# Altium schematic sheet Microcontroller.SchDoc
size A4; SheetNumber: 4; SheetTotal: 6
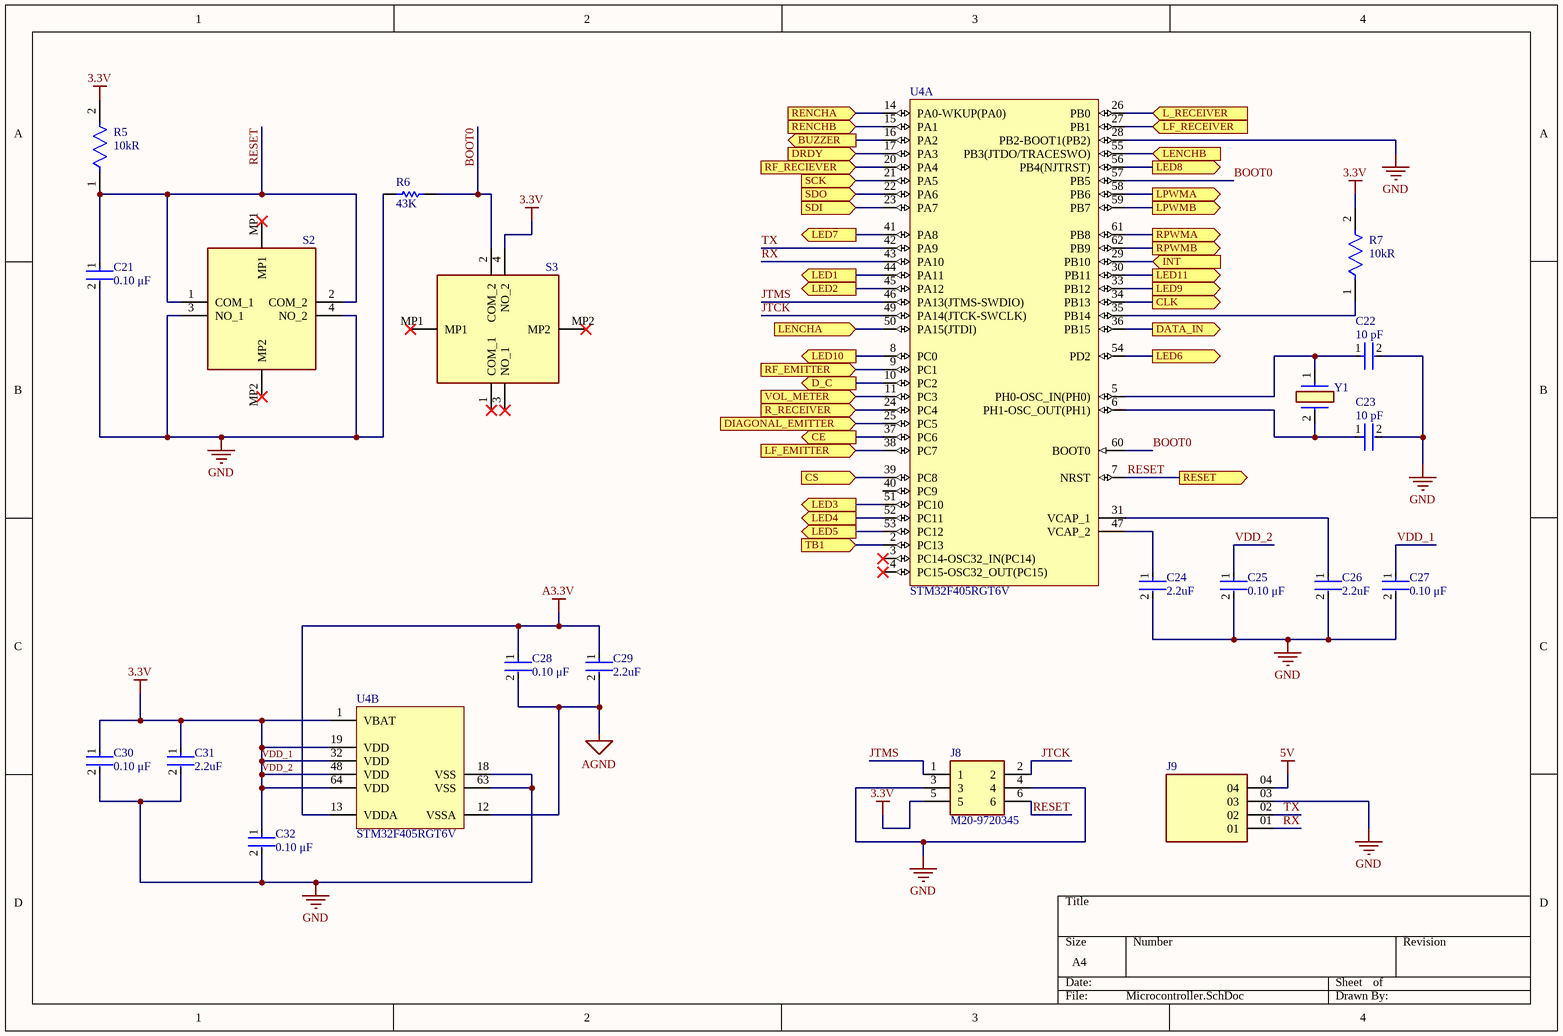
[diagram p0: Microcontroller.SchDoc]

## Parts
C21  value 0.10 μF  [FP-C0805C-DN-MFG]  (hidden comment: C0805C104J8RACTU)
C22  value 10 pF  [FP-C0805C-DN-MFG]  (hidden comment: C0805C100K5GACTU)
C23  value 10 pF  [FP-C0805C-DN-MFG]  (hidden comment: C0805C100K5GACTU)
C24  Capacitance: 2.2uF  [FP-C2012-125-0_2-IPC_C]  (hidden comment: C2012X5R1H225K125AB)
C25  value 0.10 μF  [FP-C0805C-DN-MFG]  (hidden comment: C0805C104J8RACTU)
C26  Capacitance: 2.2uF  [FP-C2012-125-0_2-IPC_C]  (hidden comment: C2012X5R1H225K125AB)
C27  value 0.10 μF  [FP-C0805C-DN-MFG]  (hidden comment: C0805C104J8RACTU)
C28  value 0.10 μF  [FP-C0805C-DN-MFG]  (hidden comment: C0805C104J8RACTU)
C29  Capacitance: 2.2uF  [FP-C2012-125-0_2-IPC_C]  (hidden comment: C2012X5R1H225K125AB)
C30  value 0.10 μF  [FP-C0805C-DN-MFG]  (hidden comment: C0805C104J8RACTU)
C31  Capacitance: 2.2uF  [FP-C2012-125-0_2-IPC_C]  (hidden comment: C2012X5R1H225K125AB)
C32  value 0.10 μF  [FP-C0805C-DN-MFG]  (hidden comment: C0805C104J8RACTU)
J8  M20-9720345  [HDRV6W64P254_2X3_762X508X864P]
J9  TS-104-G-AA  [SAMTEC_TS-104-G-AA]  (value not drawn)
R5  Resistance: 10kR  [FP-ERA3A-IPC_C]  (hidden comment: ERA-3AEB103V)
R6  value 43K  [RESC1608X55X30ML20T20]  (hidden comment: ERA3AEB433V)
R7  Resistance: 10kR  [FP-ERA3A-IPC_C]  (hidden comment: ERA-3AEB103V)
S2  TS21-34-035-BK-160-SMT-TR  [TS2134035BK160SMTTR]  (value not drawn)
S3  TS21-34-035-BK-160-SMT-TR  [TS2134035BK160SMTTR]  (value not drawn)
U4  STM32F405RGT6V  [STM-LQFP64_V]  (parts A,B of 2)
Y1  NX5032GA-16.000M-LN-CD-1  [NX5032GA16000000MHZLNCD1]  (value not drawn)

## Ports
BUZZER (out), CE (out), CLK (out), CS (in), D_C (out), DATA_IN (out), DIAGONAL_EMITTER (in), DRDY (in), INT (in), L_RECEIVER (in), LED1 (out), LED2 (out), LED3 (out), LED4 (out), LED5 (out), LED6 (out), LED7 (out), LED8 (out), LED9 (out), LED10 (out), LED11 (out), LENCHA (in), LENCHB (in), LF_EMITTER (in), LF_RECEIVER (in), LPWMA (out), LPWMB (out), R_RECEIVER (in), RENCHA (in), RENCHB (in), RESET (out), RF_EMITTER (in), RF_RECIEVER (in), RPWMA (out), RPWMB (out), SCK (in), SDI (in), SDO (in), TB1 (in), VOL_METER (in)

## Nets
5V: J9.04
A3.3V: C28.1 C29.1 U4.13(VDDA)
AGND: C28.2 C29.2 U4.12(VSSA)
GND: C21.2 C22.2 C23.2 C24.2 C25.2 C26.2 C27.2 C30.2 C31.2 C32.2 J8.3 J8.4 J9.03 R6.2 S2.3(NO_1) S2.4(NO_2) U4.18(VSS) U4.28(PB2-BOOT1(PB2)) U4.63(VSS)
VDD_1: C25.1 C27.1 C30.1 C31.1 C32.1 J8.5 R5.2 R7.2 S3.4(NO_2) U4.1(VBAT) U4.19(VDD) U4.32(VDD) U4.48(VDD) U4.64(VDD)  [also labelled 3.3V, VDD_2]
BOOT0: R6.1 S3.2(COM_2) U4.57(PB5) U4.60(BOOT0)
BUZZER: U4.16(PA2) ; port BUZZER
CE: U4.37(PC6) ; port CE
CLK: U4.34(PB13) ; port CLK
CS: U4.39(PC8) ; port CS
D_C: U4.10(PC2) ; port D_C
DATA_IN: U4.36(PB15) ; port DATA_IN
DIAGONAL_EMITTER: U4.25(PC5) ; port DIAGONAL_EMITTER
DRDY: U4.17(PA3) ; port DRDY
INT: U4.29(PB10) ; port INT
JTCK: J8.2 U4.49(PA14(JTCK-SWCLK))
JTMS: J8.1 U4.46(PA13(JTMS-SWDIO))
L_RECEIVER: U4.26(PB0) ; port L_RECEIVER
LED1: U4.44(PA11) ; port LED1
LED2: U4.45(PA12) ; port LED2
LED3: U4.51(PC10) ; port LED3
LED4: U4.52(PC11) ; port LED4
LED5: U4.53(PC12) ; port LED5
LED6: U4.54(PD2) ; port LED6
LED7: U4.41(PA8) ; port LED7
LED8: U4.56(PB4(NJTRST)) ; port LED8
LED9: U4.33(PB12) ; port LED9
LED10: U4.8(PC0) ; port LED10
LED11: U4.30(PB11) ; port LED11
LENCHA: U4.50(PA15(JTDI)) ; port LENCHA
LENCHB: U4.55(PB3(JTDO/TRACESWO)) ; port LENCHB
LF_EMITTER: U4.38(PC7) ; port LF_EMITTER
LF_RECEIVER: U4.27(PB1) ; port LF_RECEIVER
LPWMA: U4.58(PB6) ; port LPWMA
LPWMB: U4.59(PB7) ; port LPWMB
R_RECEIVER: U4.24(PC4) ; port R_RECEIVER
RENCHA: U4.14(PA0-WKUP(PA0)) ; port RENCHA
RENCHB: U4.15(PA1) ; port RENCHB
RESET: C21.1 J8.6 R5.1 S2.1(COM_1) S2.2(COM_2) U4.7(NRST) ; port RESET
RF_EMITTER: U4.9(PC1) ; port RF_EMITTER
RF_RECIEVER: U4.20(PA4) ; port RF_RECIEVER
RPWMA: U4.61(PB8) ; port RPWMA
RPWMB: U4.62(PB9) ; port RPWMB
RX: J9.01 U4.43(PA10)
SCK: U4.21(PA5) ; port SCK
SDI: U4.23(PA7) ; port SDI
SDO: U4.22(PA6) ; port SDO
TB1: U4.2(PC13) ; port TB1
TX: J9.02 U4.42(PA9)
VOL_METER: U4.11(PC3) ; port VOL_METER
NetC22_1: C22.1 U4.5(PH0-OSC_IN(PH0)) Y1.1(X1)
NetC23_1: C23.1 U4.6(PH1-OSC_OUT(PH1)) Y1.2(X2)
NetC24_1: C24.1 U4.47(VCAP_2)
NetC26_1: C26.1 U4.31(VCAP_1)
NetR7_1: R7.1 U4.35(PB14)

Not connected (* = marked no-connect by the designer): S2 MP1* MP2*; S3 1(COM_1)* 3(NO_1)* MP1* MP2*; U4 3(PC14-OSC32_IN(PC14))* 4(PC15-OSC32_OUT(PC15))* 40(PC9)

## Library data of the parts
C21 C25 C27 C28 C30 C32 = CMP-03020-032188-1: CAP CER 0.1UF 10V 5% X7R 0805; Manufacturer: KEMET; Material: Ceramic; Tolerance: 0.05; Temperature Coefficient: 30ppm/°C; Package: C0805C-DN; Device Class L1: Passive Components; Temperature: -55°C to +125°C; Category: Cap; RoHS: TRUE; Mouser Description: Multilayer Ceramic Capacitors MLCC - SMD/SMT 10volts 0.1uF X7R 5%; Lead Free: Yes; Temperature Range Low: -55°C; Temperature Range High: +125°C; Device Class L2: Capacitors; Temperature Characteristic: X7R; Device Class L3: Ceramic Capacitors; ComponentLink2Description: Datasheet; Automotive: No; Ipc Land Pattern Name: CAPC200125X78; Manufacturer Part Number: C0805C104J8RACTU; Voltage Rating: 10 V; Height: 0.88mm; Digikey Description: CAP CER 0.1UF 10V 5% X7R 0805; Octopart: https://octopart.com/c0805c104j8ractu-kemet-11807087; Capacitance: 0.10 μF; ComponentLink2URL: https://content.kemet.com/datasheets/KEM_C1003_C0G_SMD.pdf
C22 C23 = CMP-2007-00462-2: CAP CER 10PF 50V 10% NP0 0805; Manufacturer: KEMET; Temperature Characteristic: C0G; Material: Ceramic; Temperature Coefficient: 30ppm/°C; Tolerance: 0.1; Package: C0805C-DN; Device Class L2: Capacitors; Mouser Description: Multilayer Ceramic Capacitors MLCC - SMD/SMT 50volts 10pF C0G 10%; ComponentLink2URL: https://content.kemet.com/datasheets/KEM_C1003_C0G_SMD.pdf; Automotive: No; Device Class L3: Ceramic Capacitors; Temperature: -55°C to +125°C; Manufacturer Part Number: C0805C100K5GACTU; Digikey Description: CAP CER 10PF 50V 10% NP0 0805; RoHS: TRUE; Temperature Range High: +125°C; Capacitance: 10 pF; Category: Cap; Voltage Rating: 50 V; Octopart: https://octopart.com/c0805c100k5gactu-kemet-8089747; Height: 0.88mm; Lead Free: Yes; Ipc Land Pattern Name: CAPC200125X78; Temperature Range Low: -55°C; Device Class L1: Passive Components; ComponentLink2Description: Datasheet
C24 C26 C29 C31 = CMP-08246-005698-1: Multilayer Ceramic Capacitors 2.2μF ±10% 50V X5R SMD 0805; Insulation Resistance: 10GR; Dissipation Factor: 5%; Width: 1.2mm; Packaging: Tape and Reel; REACH SVHC: No SVHC; Dielectric: X5R; Dielectric Material: Ceramic; Voltage Rating: 50V; Radiation Hardening: No; Height: 1.25mm; Termination: SMD/SMT; Max Operating Temperature: 85°C; Resistor Type: Ceramic; Package Quantity: 1; Min Operating Temperature: -55°C; Weight: 0.000194oz; Thickness: 0.057inch; Lead Free: Lead Free; Tolerance: 10%; Voltage Rating (DC): 50V; RoHS Compliant: Yes; Construction: Flat; Mount: Surface Mount; Depth: 1.25mm; Length: 2mm; Case Code (Imperial): 0805; Case/Package: 0805; Series: C; Case Code (Metric): 2012
J8 = M20-9720345: Connector; Manufacturer_Name: Harwin; Datasheet Link: https://cdn.harwin.com/pdfs/M20-972.pdf; Height: 8.64mm; Manufacturer_Part_Number: M20-9720345; Mouser Part Number: 855-M20-9720345; Mouser Price/Stock: https://www.mouser.co.uk/ProductDetail/Harwin/M20-9720345?qs=vF78I%252BjhbY8b2N4EUBH%2Fyg%3D%3D
J9 = TS-104-G-AA: MF: Samtec Inc.; Price: None; Package: None; Availability: Unavailable; Value: *; MP: TS-104-G-AA
R5 R7 = CMP-2000-00874-2: RES SMD 10K OHM 0.1% 1/10W 0603; Voltage Rating (DC): 75V; Power Rating: 100mW; Temperature Coefficient: 25ppm/°C; Radiation Hardening: No; Width: 0.8mm; Depth: 0.8mm; Construction: Rectangular; Case Code (Metric): 1608; Package Quantity: 5000; Length: 1.6mm; Size Code: 0603; Case Code (Imperial): 0603; Termination: SMD/SMT; Contact Plating: Tin; Resistance Tolerance: 0.1%; Military Standard: Not; Packaging: Tape and Reel; Max Power Dissipation: 100mW; REACH SVHC: No SVHC; Series: ERA-3A; Voltage Rating: 75V; Lead Free: Lead Free; Technology: METAL FILM; RoHS Compliant: Yes; Max Operating Temperature: 155°C; Resistor Type: Thin Film; Min Operating Temperature: -55°C; Number of Pins: 2; Case/Package: 0603; Tolerance: 0.1%; Height: 0.45mm; Mount: Surface Mount; Number of Terminations: 2
R6 = CMP-2000-00064-1: Manufacturer: Panasonic; Part Number: ERA3AEB433V
S2 S3 = TS21-34-035-BK-160-SMT-TR: Switch; Manufacturer_Name: CUI Devices; Datasheet Link: https://www.cuidevices.com/product/resource/ts21.pdf; Height: 1.7mm; Manufacturer_Part_Number: TS21-34-035-BK-160-SMT-TR; Mouser Part Number: 179-134035BK160SMTTR; Mouser Price/Stock: https://www.mouser.co.uk/ProductDetail/CUI-Devices/TS21-34-035-BK-160-SMT-TR?qs=1Kr7Jg1SGW9zzGN58LP5Sg%3D%3D
U4 = CMP-0243-00092-2: ARM Cortex-M4 32-bit MCU+FPU, 210 DMIPS, 1024 kB Flash, 192 kB Internal RAM, 51 I/Os, 64-pin LQFP, -40 to 85 degC, Tray; Manufacturer: STMicroelectronics; FLASH Size (Prog) (kB): 1024; D/A Converter: 2x12-bit; Supply Voltage(Vcc) min (V): 1.8; Operating Frequency(F) (Processor speed) (MHz): 168; Internal RAM Size (kB): 192; Supply Voltage(Vcc) max (V): 3.6; I/Os (High Current): 51; ComponentLink2URL: http://www.st.com/st-web-ui/static/active/en/resource/technical/document/datasheet/DM00037051.pdf; ComponentLink3URL: http://www.st.com/st-web-ui/static/active/en/resource/technical/document/datasheet/DM00037051.pdf; Mounting Technology: Surface Mount; PackageReference: LQFP64; ComponentLink2Description: Datasheet; Core: ARM Cortex-M4; ComponentLink1Description: Manufacturer URL; ComponentLink1URL: http://www.st.com/web/en/home.html; PartNumber: STM32F405RGT6V; PackageVersion: Rev. 4, 06/2013; Packing: Tray; DatasheetVersion: Rev. 4; PackageDescription: 64-Pin Low Profile Quad Flat Package, 10 x 10 mm Body, 0.5 mm Pitch; ComponentLink3Description: Package Specification
Y1 = NX5032GA-16.000M-LN-CD-1: Crystal or Oscillator; Manufacturer_Name: NDK; Datasheet Link: https://media.digikey.com/pdf/Data%20Sheets/NDK%20PDFs/NX5032GA.pdf; Height: 1.5mm; Manufacturer_Part_Number: NX5032GA-16.000M-LN-CD-1; Mouser Part Number: 344-NX5032GA16MLNCD1; Mouser Price/Stock: https://www.mouser.co.uk/ProductDetail/NDK/NX5032GA-16.000M-LN-CD-1?qs=55YtniHzbhDnyNixVDBwYw%3D%3D